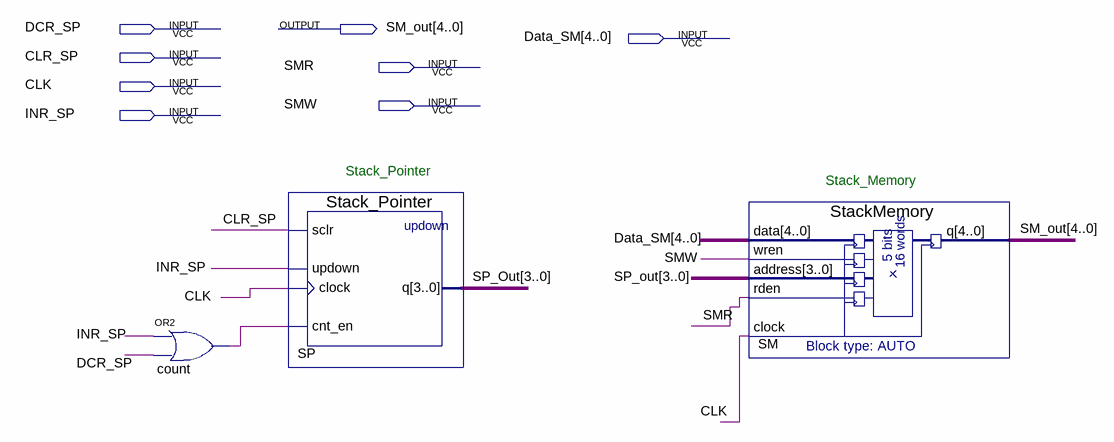
[diagram p0: schematic sheet]
// Quartus schematic 2019510083_Ata_Can_Yaymaci_SMU.bdf as structural Verilog: 3 symbols, 8 pins
module \2019510083_Ata_Can_Yaymaci_SMU  (
  input  DCR_SP,
  input  [4:0] Data_SM,
  input  CLR_SP,
  input  SMR,
  input  CLK,
  input  SMW,
  input  INR_SP,
  output [4:0] SM_out
);

  wire count_out;
  wire [3:0] SP_Out;

  or count (count_out, INR_SP, DCR_SP);
  Stack_Pointer SP (.sclr(CLR_SP), .updown(INR_SP), .clock(CLK), .cnt_en(count_out), .q(SP_Out));
  StackMemory SM (.data(Data_SM), .wren(SMW), .address(SP_Out), .rden(SMR), .clock(CLK), .q(SM_out));

  // Notes on the sheet:
  //   Stack_Pointer
  //   Stack_Memory
endmodule
